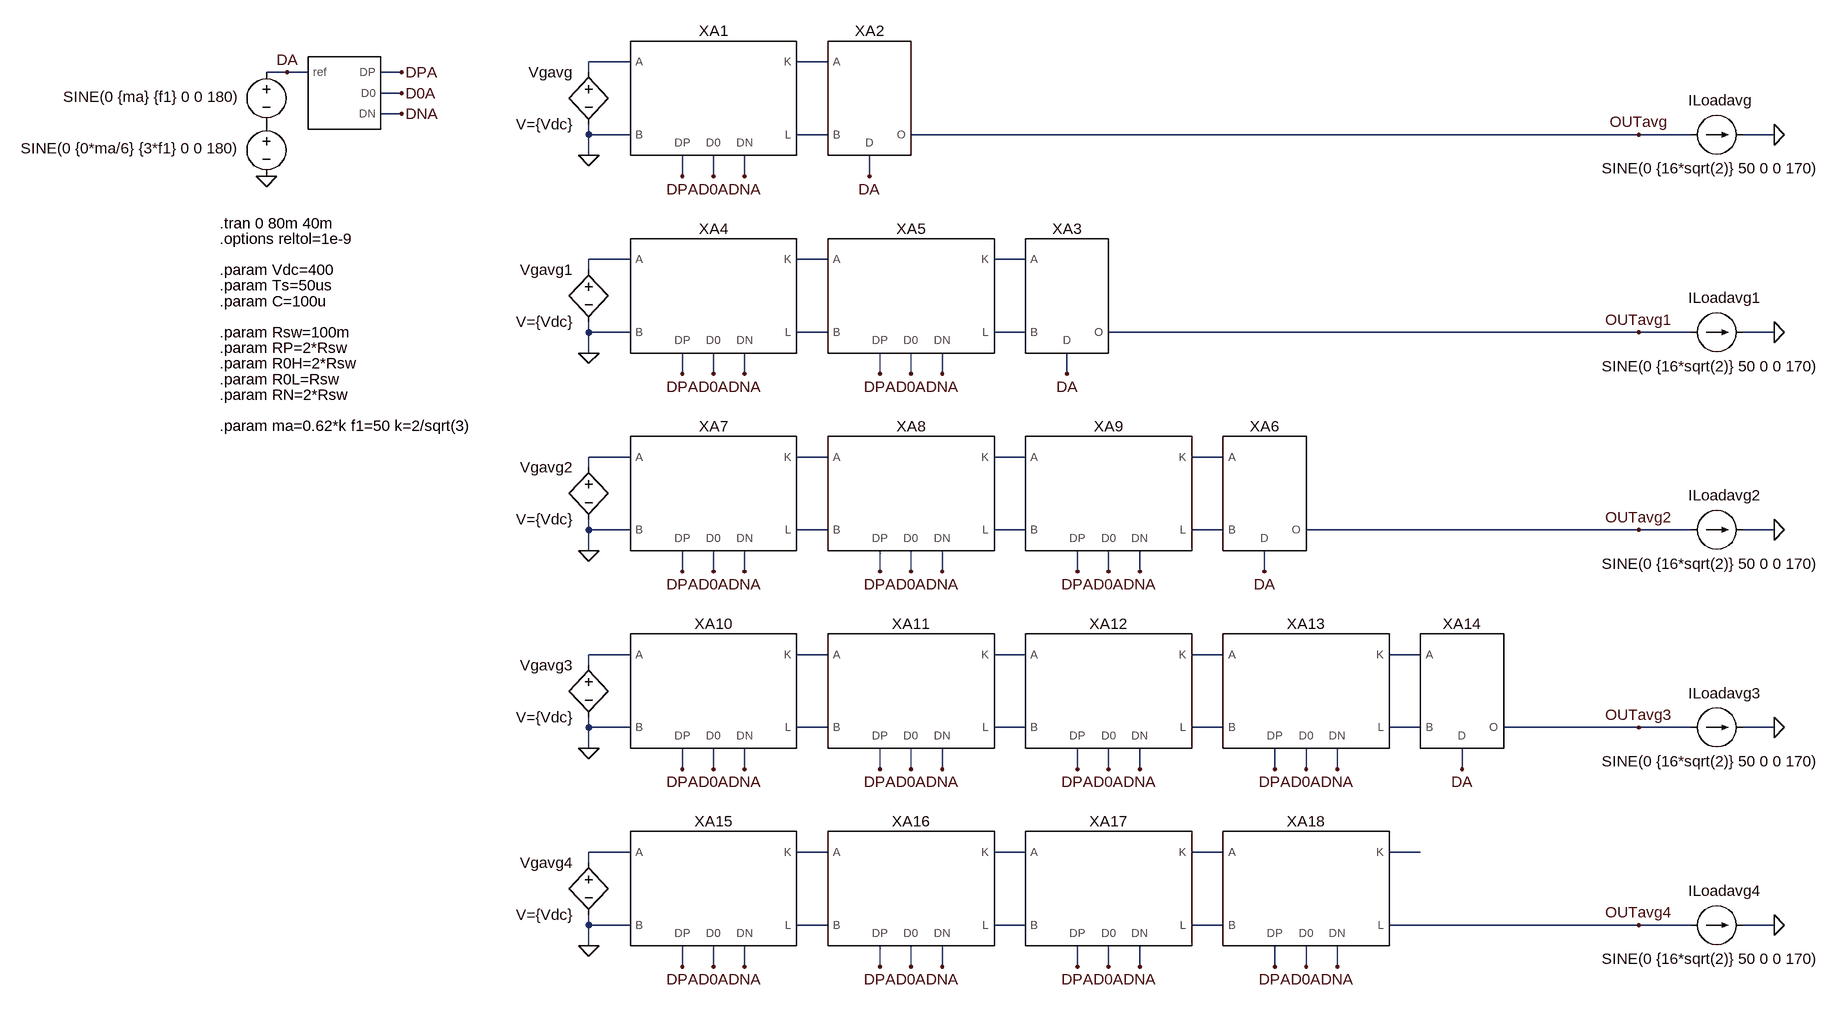
[diagram p0: schematic converter_scaling.asc]
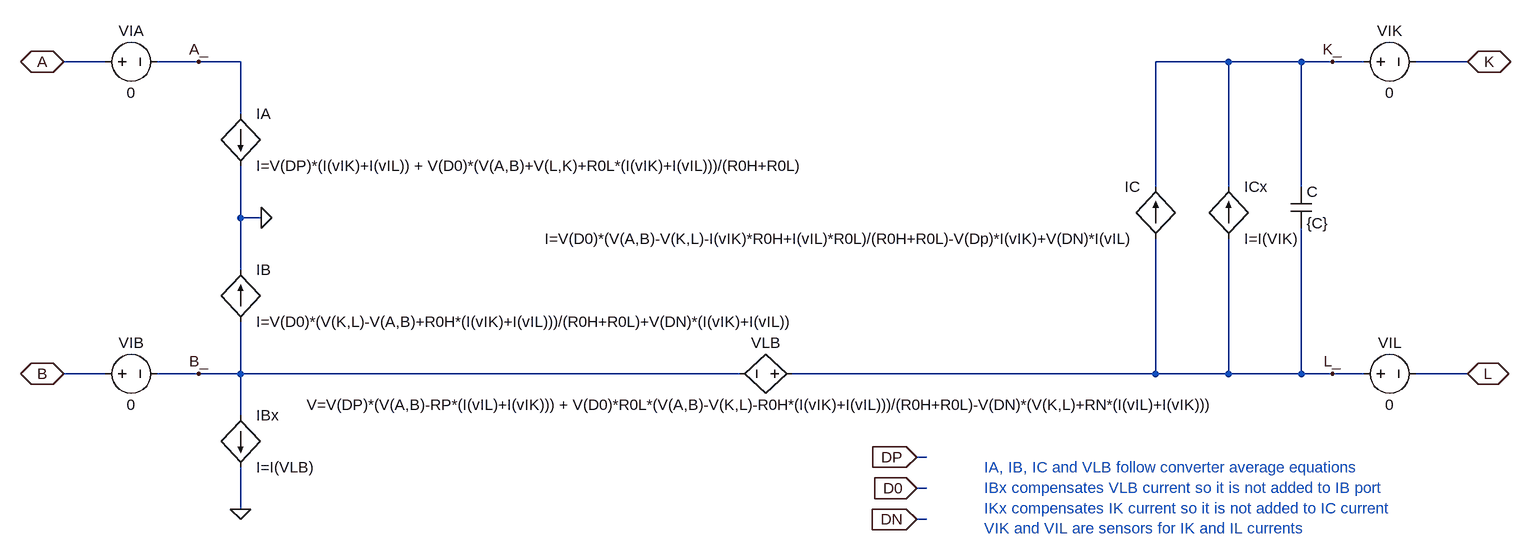
[diagram p1: sub-circuit pn_average_model.asc]
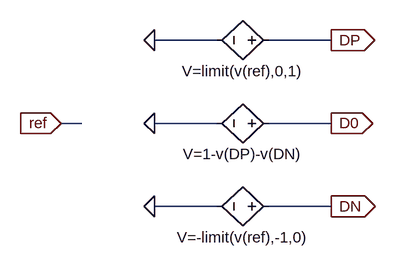
[diagram p2: sub-circuit pn_average_modulator.asc]
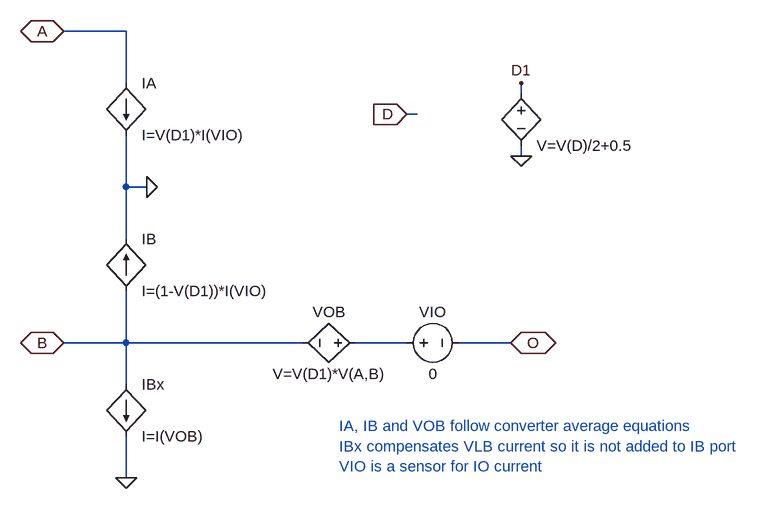
[diagram p3: sub-circuit 2l_average_model.asc]
converter_scaling.asc, the LTspice schematic file:
Version 4
SHEET 1 4616 1844
WIRE 2272 -1392 2208 -1392
WIRE 2576 -1392 2528 -1392
WIRE 1744 -1376 1712 -1376
WIRE 1776 -1376 1744 -1376
WIRE 1920 -1376 1888 -1376
WIRE 2208 -1376 2208 -1392
WIRE 1920 -1344 1888 -1344
WIRE 1920 -1312 1888 -1312
WIRE 2208 -1280 2208 -1296
WIRE 2272 -1280 2208 -1280
WIRE 2576 -1280 2528 -1280
WIRE 3824 -1280 2704 -1280
WIRE 3904 -1280 3824 -1280
WIRE 4032 -1280 3984 -1280
WIRE 2208 -1248 2208 -1280
WIRE 2352 -1216 2352 -1248
WIRE 2400 -1216 2400 -1248
WIRE 2448 -1216 2448 -1248
WIRE 2640 -1216 2640 -1248
WIRE 2272 -1088 2208 -1088
WIRE 2576 -1088 2528 -1088
WIRE 2880 -1088 2832 -1088
WIRE 2208 -1072 2208 -1088
WIRE 2208 -976 2208 -992
WIRE 2272 -976 2208 -976
WIRE 2576 -976 2528 -976
WIRE 2880 -976 2832 -976
WIRE 3824 -976 3008 -976
WIRE 3904 -976 3824 -976
WIRE 4032 -976 3984 -976
WIRE 2208 -944 2208 -976
WIRE 2352 -912 2352 -944
WIRE 2400 -912 2400 -944
WIRE 2448 -912 2448 -944
WIRE 2656 -912 2656 -944
WIRE 2704 -912 2704 -944
WIRE 2752 -912 2752 -944
WIRE 2944 -912 2944 -944
WIRE 2272 -784 2208 -784
WIRE 2576 -784 2528 -784
WIRE 2880 -784 2832 -784
WIRE 3184 -784 3136 -784
WIRE 2208 -768 2208 -784
WIRE 2208 -672 2208 -688
WIRE 2272 -672 2208 -672
WIRE 2576 -672 2528 -672
WIRE 2880 -672 2832 -672
WIRE 3184 -672 3136 -672
WIRE 3824 -672 3312 -672
WIRE 3904 -672 3824 -672
WIRE 4032 -672 3984 -672
WIRE 2208 -640 2208 -672
WIRE 2352 -608 2352 -640
WIRE 2400 -608 2400 -640
WIRE 2448 -608 2448 -640
WIRE 2656 -608 2656 -640
WIRE 2704 -608 2704 -640
WIRE 2752 -608 2752 -640
WIRE 2960 -608 2960 -640
WIRE 3008 -608 3008 -640
WIRE 3056 -608 3056 -640
WIRE 3248 -608 3248 -640
WIRE 2272 -480 2208 -480
WIRE 2576 -480 2528 -480
WIRE 2880 -480 2832 -480
WIRE 3184 -480 3136 -480
WIRE 3488 -480 3440 -480
WIRE 2208 -464 2208 -480
WIRE 2208 -368 2208 -384
WIRE 2272 -368 2208 -368
WIRE 2576 -368 2528 -368
WIRE 2880 -368 2832 -368
WIRE 3184 -368 3136 -368
WIRE 3488 -368 3440 -368
WIRE 3824 -368 3616 -368
WIRE 3904 -368 3824 -368
WIRE 4032 -368 3984 -368
WIRE 2208 -336 2208 -368
WIRE 2352 -304 2352 -336
WIRE 2400 -304 2400 -336
WIRE 2448 -304 2448 -336
WIRE 2656 -304 2656 -336
WIRE 2704 -304 2704 -336
WIRE 2752 -304 2752 -336
WIRE 2960 -304 2960 -336
WIRE 3008 -304 3008 -336
WIRE 3056 -304 3056 -336
WIRE 3264 -304 3264 -336
WIRE 3312 -304 3312 -336
WIRE 3360 -304 3360 -336
WIRE 3552 -304 3552 -336
WIRE 2272 -176 2208 -176
WIRE 2576 -176 2528 -176
WIRE 2880 -176 2832 -176
WIRE 3184 -176 3136 -176
WIRE 3488 -176 3440 -176
WIRE 2208 -160 2208 -176
WIRE 2208 -64 2208 -80
WIRE 2272 -64 2208 -64
WIRE 2576 -64 2528 -64
WIRE 2880 -64 2832 -64
WIRE 3184 -64 3136 -64
WIRE 3824 -64 3440 -64
WIRE 3904 -64 3824 -64
WIRE 4032 -64 3984 -64
WIRE 2208 -32 2208 -64
WIRE 2352 0 2352 -32
WIRE 2400 0 2400 -32
WIRE 2448 0 2448 -32
WIRE 2656 0 2656 -32
WIRE 2704 0 2704 -32
WIRE 2752 0 2752 -32
WIRE 2960 0 2960 -32
WIRE 3008 0 3008 -32
WIRE 3056 0 3056 -32
WIRE 3264 0 3264 -32
WIRE 3312 0 3312 -32
WIRE 3360 0 3360 -32
FLAG 2352 -1216 DPA
FLAG 2400 -1216 D0A
FLAG 2448 -1216 DNA
FLAG 2208 -1248 0
FLAG 1920 -1376 DPA
FLAG 1920 -1344 D0A
FLAG 1920 -1312 DNA
FLAG 1712 -1216 0
FLAG 1744 -1376 DA
FLAG 4032 -1280 0
FLAG 3824 -1280 OUTavg
FLAG 2352 -912 DPA
FLAG 2400 -912 D0A
FLAG 2448 -912 DNA
FLAG 2208 -944 0
FLAG 4032 -976 0
FLAG 3824 -976 OUTavg1
FLAG 2656 -912 DPA
FLAG 2704 -912 D0A
FLAG 2752 -912 DNA
FLAG 2352 -608 DPA
FLAG 2400 -608 D0A
FLAG 2448 -608 DNA
FLAG 2208 -640 0
FLAG 4032 -672 0
FLAG 3824 -672 OUTavg2
FLAG 2656 -608 DPA
FLAG 2704 -608 D0A
FLAG 2752 -608 DNA
FLAG 2960 -608 DPA
FLAG 3008 -608 D0A
FLAG 3056 -608 DNA
FLAG 2352 -304 DPA
FLAG 2400 -304 D0A
FLAG 2448 -304 DNA
FLAG 2208 -336 0
FLAG 4032 -368 0
FLAG 3824 -368 OUTavg3
FLAG 2656 -304 DPA
FLAG 2704 -304 D0A
FLAG 2752 -304 DNA
FLAG 2960 -304 DPA
FLAG 3008 -304 D0A
FLAG 3056 -304 DNA
FLAG 3264 -304 DPA
FLAG 3312 -304 D0A
FLAG 3360 -304 DNA
FLAG 2640 -1216 DA
FLAG 2944 -912 DA
FLAG 3248 -608 DA
FLAG 3552 -304 DA
FLAG 2352 0 DPA
FLAG 2400 0 D0A
FLAG 2448 0 DNA
FLAG 2208 -32 0
FLAG 4032 -64 0
FLAG 3824 -64 OUTavg4
FLAG 2656 0 DPA
FLAG 2704 0 D0A
FLAG 2752 0 DNA
FLAG 2960 0 DPA
FLAG 3008 0 D0A
FLAG 3056 0 DNA
FLAG 3264 0 DPA
FLAG 3312 0 D0A
FLAG 3360 0 DNA
SYMBOL bv 2208 -1392 M0
SYMATTR InstName Vgavg
SYMATTR Value V={Vdc}
SYMBOL PN_average_model 2400 -1344 R0
SYMATTR InstName XA1
SYMATTR SpiceLine C={C} RP={RP} R0H={R0H} R0L={R0L} RN={RN}
SYMBOL voltage 1712 -1392 M0
WINDOW 0 24 16 Invisible 2
WINDOW 3 39 54 Left 2
SYMATTR InstName V1
SYMATTR Value SINE(0 {ma} {f1} 0 0 180)
SYMBOL voltage 1712 -1312 M0
WINDOW 0 24 16 Invisible 2
WINDOW 3 39 53 Left 2
SYMATTR InstName V7
SYMATTR Value SINE(0 {0*ma/6} {3*f1} 0 0 180)
SYMBOL PN_average_modulator 1824 -1344 R0
WINDOW 0 8 -56 Invisible 2
SYMATTR InstName X2
SYMBOL current 3904 -1280 M90
WINDOW 123 0 0 Left 2
WINDOW 39 0 0 Left 2
WINDOW 3 52 -137 VRight 2
WINDOW 0 -53 -4 VRight 2
SYMATTR Value SINE(0 {16*sqrt(2)} 50 0 0 170)
SYMATTR InstName ILoadavg
SYMBOL bv 2208 -1088 M0
SYMATTR InstName Vgavg1
SYMATTR Value V={Vdc}
SYMBOL PN_average_model 2400 -1040 R0
SYMATTR InstName XA4
SYMATTR SpiceLine C={2*C} RP={RP/2} R0H={R0H/2} R0L={R0L/2} RN={RN/2}
SYMBOL current 3904 -976 M90
WINDOW 123 0 0 Left 2
WINDOW 39 0 0 Left 2
WINDOW 3 52 -137 VRight 2
WINDOW 0 -53 -4 VRight 2
SYMATTR Value SINE(0 {16*sqrt(2)} 50 0 0 170)
SYMATTR InstName ILoadavg1
SYMBOL PN_average_model 2704 -1040 R0
SYMATTR InstName XA5
SYMATTR SpiceLine C={C} RP={RP} R0H={R0H} R0L={R0L} RN={RN}
SYMBOL bv 2208 -784 M0
SYMATTR InstName Vgavg2
SYMATTR Value V={Vdc}
SYMBOL PN_average_model 2400 -736 R0
SYMATTR InstName XA7
SYMATTR SpiceLine C={C*3} RP={RP/3} R0H={R0H/3} R0L={R0L/3} RN={RN/3}
SYMBOL current 3904 -672 M90
WINDOW 123 0 0 Left 2
WINDOW 39 0 0 Left 2
WINDOW 3 52 -137 VRight 2
WINDOW 0 -53 -4 VRight 2
SYMATTR Value SINE(0 {16*sqrt(2)} 50 0 0 170)
SYMATTR InstName ILoadavg2
SYMBOL PN_average_model 2704 -736 R0
SYMATTR InstName XA8
SYMATTR SpiceLine C={C*2} RP={RP/2} R0H={R0H/2} R0L={R0L/2} RN={RN/2}
SYMBOL PN_average_model 3008 -736 R0
SYMATTR InstName XA9
SYMATTR SpiceLine C={C} RP={RP} R0H={R0H} R0L={R0L} RN={RN}
SYMBOL bv 2208 -480 M0
SYMATTR InstName Vgavg3
SYMATTR Value V={Vdc}
SYMBOL PN_average_model 2400 -432 R0
SYMATTR InstName XA10
SYMATTR SpiceLine C={C*4} RP={RP/4} R0H={R0H/4} R0L={R0L/4} RN={RN/4}
SYMBOL current 3904 -368 M90
WINDOW 123 0 0 Left 2
WINDOW 39 0 0 Left 2
WINDOW 3 52 -137 VRight 2
WINDOW 0 -53 -4 VRight 2
SYMATTR Value SINE(0 {16*sqrt(2)} 50 0 0 170)
SYMATTR InstName ILoadavg3
SYMBOL PN_average_model 2704 -432 R0
SYMATTR InstName XA11
SYMATTR SpiceLine C={C*3} RP={RP/3} R0H={R0H/3} R0L={R0L/3} RN={RN/3}
SYMBOL PN_average_model 3008 -432 R0
SYMATTR InstName XA12
SYMATTR SpiceLine C={C*2} RP={RP/2} R0H={R0H/2} R0L={R0L/2} RN={RN/2}
SYMBOL PN_average_model 3312 -432 R0
SYMATTR InstName XA13
SYMATTR SpiceLine C={C} RP={RP} R0H={R0H} R0L={R0L} RN={RN}
SYMBOL 2L_average_model 2640 -1360 R0
SYMATTR InstName XA2
SYMBOL 2L_average_model 2944 -1056 R0
SYMATTR InstName XA3
SYMBOL 2L_average_model 3248 -752 R0
SYMATTR InstName XA6
SYMBOL 2L_average_model 3552 -448 R0
SYMATTR InstName XA14
SYMBOL bv 2208 -176 M0
SYMATTR InstName Vgavg4
SYMATTR Value V={Vdc}
SYMBOL PN_average_model 2400 -128 R0
SYMATTR InstName XA15
SYMATTR SpiceLine C={C*4} RP={RP/4} R0H={R0H/4} R0L={R0L/4} RN={RN/4}
SYMBOL current 3904 -64 M90
WINDOW 123 0 0 Left 2
WINDOW 39 0 0 Left 2
WINDOW 3 52 -137 VRight 2
WINDOW 0 -53 -4 VRight 2
SYMATTR Value SINE(0 {16*sqrt(2)} 50 0 0 170)
SYMATTR InstName ILoadavg4
SYMBOL PN_average_model 2704 -128 R0
SYMATTR InstName XA16
SYMATTR SpiceLine C={C*3} RP={RP/3} R0H={R0H/3} R0L={R0L/3} RN={RN/3}
SYMBOL PN_average_model 3008 -128 R0
SYMATTR InstName XA17
SYMATTR SpiceLine C={C*2} RP={RP/2} R0H={R0H/2} R0L={R0L/2} RN={RN/2}
SYMBOL PN_average_model 3312 -128 R0
SYMATTR InstName XA18
SYMATTR SpiceLine C={C} RP={RP} R0H={R0H} R0L={R0L} RN={RN}
TEXT 1640 -1048 Left 2 !.param Ts=50us
TEXT 1640 -1144 Left 2 !.tran 0 80m 40m
TEXT 1640 -1072 Left 2 !.param Vdc=400
TEXT 1640 -832 Left 2 !.param ma=0.62*k f1=50 k=2/sqrt(3)
TEXT 1640 -976 Left 2 !.param Rsw=100m
TEXT 1640 -952 Left 2 !.param RP=2*Rsw
TEXT 1640 -880 Left 2 !.param RN=2*Rsw
TEXT 1640 -928 Left 2 !.param R0H=2*Rsw
TEXT 1640 -904 Left 2 !.param R0L=Rsw
TEXT 1640 -1024 Left 2 !.param C=100u
TEXT 1640 -1120 Left 2 !.options reltol=1e-9

pn_average_model.asc, the sub-circuit schematic file:
Version 4
SHEET 1 2060 780
WIRE -720 16 -784 16
WIRE -576 16 -640 16
WIRE -512 16 -576 16
WIRE 1008 16 896 16
WIRE 1120 16 1008 16
WIRE 1168 16 1120 16
WIRE 1216 16 1168 16
WIRE 1376 16 1296 16
WIRE -512 96 -512 16
WIRE 896 208 896 16
WIRE 1008 208 1008 16
WIRE 1120 208 1120 16
WIRE -512 256 -512 176
WIRE -480 256 -512 256
WIRE -512 336 -512 256
WIRE -720 496 -784 496
WIRE -576 496 -640 496
WIRE -512 496 -512 416
WIRE -512 496 -576 496
WIRE 256 496 -512 496
WIRE 896 496 896 288
WIRE 896 496 336 496
WIRE 1008 496 1008 288
WIRE 1008 496 896 496
WIRE 1120 496 1120 272
WIRE 1120 496 1008 496
WIRE 1168 496 1120 496
WIRE 1216 496 1168 496
WIRE 1376 496 1296 496
WIRE -512 560 -512 496
WIRE 544 624 528 624
WIRE 544 672 528 672
WIRE -512 704 -512 640
WIRE 544 720 528 720
FLAG 1376 16 K
IOPIN 1376 16 BiDir
FLAG 1376 496 L
IOPIN 1376 496 BiDir
FLAG -784 16 A
IOPIN -784 16 BiDir
FLAG -784 496 B
IOPIN -784 496 BiDir
FLAG 528 624 DP
IOPIN 528 624 In
FLAG 528 672 D0
IOPIN 528 672 In
FLAG 528 720 DN
IOPIN 528 720 In
FLAG -480 256 0
FLAG -512 704 0
FLAG -576 16 A_
FLAG -576 496 B_
FLAG 1168 16 K_
FLAG 1168 496 L_
SYMBOL bv 352 496 R90
WINDOW 0 -32 56 VBottom 2
WINDOW 3 32 56 VTop 2
SYMATTR InstName VLB
SYMATTR Value V=V(DP)*(V(A,B)-RP*(I(vIL)+I(vIK))) + V(D0)*R0L*(V(A,B)-V(K,L)-R0H*(I(vIK)+I(vIL)))/(R0H+R0L)-V(DN)*(V(K,L)+RN*(I(vIL)+I(vIK)))
SYMBOL bi -512 96 R0
SYMATTR InstName IA
SYMATTR Value I=V(DP)*(I(vIK)+I(vIL)) + V(D0)*(V(A,B)+V(L,K)+R0L*(I(vIK)+I(vIL)))/(R0H+R0L)
SYMBOL cap 1104 208 R0
SYMATTR InstName C
SYMATTR Value {C}
SYMBOL bi 896 288 R180
WINDOW 0 24 80 Left 2
WINDOW 3 24 0 Left 2
SYMATTR InstName IC
SYMATTR Value I=V(D0)*(V(A,B)-V(K,L)-I(vIK)*R0H+I(vIL)*R0L)/(R0H+R0L)-V(Dp)*I(vIK)+V(DN)*I(vIL)
SYMBOL bi -512 416 M180
WINDOW 0 24 80 Left 2
WINDOW 3 24 0 Left 2
SYMATTR InstName IB
SYMATTR Value I=V(D0)*(V(K,L)-V(A,B)+R0H*(I(vIK)+I(vIL)))/(R0H+R0L)+V(DN)*(I(vIK)+I(vIL))
SYMBOL voltage 1200 496 R270
WINDOW 0 32 56 VTop 2
WINDOW 3 -32 56 VBottom 2
SYMATTR InstName VIL
SYMATTR Value 0
SYMBOL voltage 1200 16 R270
WINDOW 0 32 56 VTop 2
WINDOW 3 -32 56 VBottom 2
SYMATTR InstName VIK
SYMATTR Value 0
SYMBOL bi -512 560 R0
SYMATTR InstName IBx
SYMATTR Value I=I(VLB)
SYMBOL bi 1008 288 M180
WINDOW 0 24 80 Left 2
WINDOW 3 24 0 Left 2
SYMATTR InstName ICx
SYMATTR Value I=I(VIK)
SYMBOL voltage -736 496 R270
WINDOW 0 32 56 VTop 2
WINDOW 3 -32 56 VBottom 2
SYMATTR InstName VIB
SYMATTR Value 0
SYMBOL voltage -736 16 R270
WINDOW 0 32 56 VTop 2
WINDOW 3 -32 56 VBottom 2
SYMATTR InstName VIA
SYMATTR Value 0
TEXT 632 640 Left 2 ;IA, IB, IC and VLB follow converter average equations\nIBx compensates VLB current so it is not added to IB port\nIKx compensates IK current so it is not added to IC current\nVIK and VIL are sensors for IK and IL currents

pn_average_modulator.asc, the sub-circuit schematic file:
Version 4
SHEET 1 880 680
WIRE 304 160 208 160
WIRE 480 160 384 160
WIRE 96 288 64 288
WIRE 304 288 208 288
WIRE 480 288 384 288
WIRE 304 416 208 416
WIRE 480 416 384 416
FLAG 208 160 0
FLAG 208 288 0
FLAG 208 416 0
FLAG 480 160 DP
IOPIN 480 160 Out
FLAG 480 288 D0
IOPIN 480 288 Out
FLAG 480 416 DN
IOPIN 480 416 Out
FLAG 64 288 ref
IOPIN 64 288 In
SYMBOL bv 400 160 R90
WINDOW 0 -32 56 Invisible 2
WINDOW 3 32 56 VTop 2
SYMATTR InstName Bpos1
SYMATTR Value V=limit(v(ref),0,1)
SYMBOL bv 400 288 R90
WINDOW 0 -32 56 Invisible 2
WINDOW 3 32 56 VTop 2
SYMATTR InstName Bzero1
SYMATTR Value V=1-v(DP)-v(DN)
SYMBOL bv 400 416 R90
WINDOW 0 -32 56 Invisible 2
WINDOW 3 32 56 VTop 2
SYMATTR InstName Bneg1
SYMATTR Value V=-limit(v(ref),-1,0)

2l_average_model.asc, the sub-circuit schematic file:
Version 4
SHEET 1 2060 780
WIRE -512 16 -608 16
WIRE -512 96 -512 16
WIRE 96 112 96 96
WIRE -64 144 -80 144
WIRE 96 208 96 192
WIRE -512 256 -512 176
WIRE -480 256 -512 256
WIRE -512 336 -512 256
WIRE -512 496 -512 416
WIRE -512 496 -608 496
WIRE -240 496 -512 496
WIRE -80 496 -160 496
WIRE 80 496 0 496
WIRE -512 560 -512 496
WIRE -512 704 -512 640
FLAG 80 496 O
IOPIN 80 496 BiDir
FLAG -608 16 A
IOPIN -608 16 BiDir
FLAG -608 496 B
IOPIN -608 496 BiDir
FLAG -80 144 D
IOPIN -80 144 In
FLAG -480 256 0
FLAG -512 704 0
FLAG 96 208 0
FLAG 96 96 D1
SYMBOL bv -144 496 R90
WINDOW 0 -32 56 VBottom 2
WINDOW 3 32 56 VTop 2
SYMATTR InstName VOB
SYMATTR Value V=V(D1)*V(A,B)
SYMBOL bi -512 96 R0
SYMATTR InstName IA
SYMATTR Value I=V(D1)*I(VIO)
SYMBOL bi -512 416 M180
WINDOW 0 24 80 Left 2
WINDOW 3 24 0 Left 2
SYMATTR InstName IB
SYMATTR Value I=(1-V(D1))*I(VIO)
SYMBOL voltage -96 496 R270
WINDOW 0 32 56 VTop 2
WINDOW 3 -32 56 VBottom 2
SYMATTR InstName VIO
SYMATTR Value 0
SYMBOL bi -512 560 R0
SYMATTR InstName IBx
SYMATTR Value I=I(VOB)
SYMBOL bv 96 96 R0
WINDOW 0 24 16 Invisible 2
SYMATTR InstName VD
SYMATTR Value V=V(D)/2+0.5
TEXT -184 624 Left 2 ;IA, IB and VOB follow converter average equations\nIBx compensates VLB current so it is not added to IB port\nVIO is a sensor for IO current

The netlist it stands for:
* converter_scaling.asc
B§Vgavg N001 0 V={Vdc}
XXA1 D0A DNA DPA N001 0 N002 N003 pn_average_model params: C={C} RP={RP} R0H={R0H} R0L={R0L} RN={RN}
V1 DA P001 SINE(0 {ma} {f1} 0 0 180)
V7 P001 0 SINE(0 {0*ma/6} {3*f1} 0 0 180)
XX2 DA D0A DNA DPA pn_average_modulator
ILoadavg OUTavg 0 SINE(0 {16*sqrt(2)} 50 0 0 170)
B§Vgavg1 N004 0 V={Vdc}
XXA4 D0A DNA DPA N004 0 N005 N007 pn_average_model params: C={2*C} RP={RP/2} R0H={R0H/2} R0L={R0L/2} RN={RN/2}
ILoadavg1 OUTavg1 0 SINE(0 {16*sqrt(2)} 50 0 0 170)
XXA5 D0A DNA DPA N005 N007 N006 N008 pn_average_model params: C={C} RP={RP} R0H={R0H} R0L={R0L} RN={RN}
B§Vgavg2 N009 0 V={Vdc}
XXA7 D0A DNA DPA N009 0 N010 N013 pn_average_model params: C={C*3} RP={RP/3} R0H={R0H/3} R0L={R0L/3} RN={RN/3}
ILoadavg2 OUTavg2 0 SINE(0 {16*sqrt(2)} 50 0 0 170)
XXA8 D0A DNA DPA N010 N013 N011 N014 pn_average_model params: C={C*2} RP={RP/2} R0H={R0H/2} R0L={R0L/2} RN={RN/2}
XXA9 D0A DNA DPA N011 N014 N012 N015 pn_average_model params: C={C} RP={RP} R0H={R0H} R0L={R0L} RN={RN}
B§Vgavg3 N016 0 V={Vdc}
XXA10 D0A DNA DPA N016 0 N017 N021 pn_average_model params: C={C*4} RP={RP/4} R0H={R0H/4} R0L={R0L/4} RN={RN/4}
ILoadavg3 OUTavg3 0 SINE(0 {16*sqrt(2)} 50 0 0 170)
XXA11 D0A DNA DPA N017 N021 N018 N022 pn_average_model params: C={C*3} RP={RP/3} R0H={R0H/3} R0L={R0L/3} RN={RN/3}
XXA12 D0A DNA DPA N018 N022 N019 N023 pn_average_model params: C={C*2} RP={RP/2} R0H={R0H/2} R0L={R0L/2} RN={RN/2}
XXA13 D0A DNA DPA N019 N023 N020 N024 pn_average_model params: C={C} RP={RP} R0H={R0H} R0L={R0L} RN={RN}
XXA2 DA N002 N003 OUTavg 2l_average_model
XXA3 DA N006 N008 OUTavg1 2l_average_model
XXA6 DA N012 N015 OUTavg2 2l_average_model
XXA14 DA N020 N024 OUTavg3 2l_average_model
B§Vgavg4 N025 0 V={Vdc}
XXA15 D0A DNA DPA N025 0 N026 N030 pn_average_model params: C={C*4} RP={RP/4} R0H={R0H/4} R0L={R0L/4} RN={RN/4}
ILoadavg4 OUTavg4 0 SINE(0 {16*sqrt(2)} 50 0 0 170)
XXA16 D0A DNA DPA N026 N030 N027 N031 pn_average_model params: C={C*3} RP={RP/3} R0H={R0H/3} R0L={R0L/3} RN={RN/3}
XXA17 D0A DNA DPA N027 N031 N028 N032 pn_average_model params: C={C*2} RP={RP/2} R0H={R0H/2} R0L={R0L/2} RN={RN/2}
XXA18 D0A DNA DPA N028 N032 N029 OUTavg4 pn_average_model params: C={C} RP={RP} R0H={R0H} R0L={R0L} RN={RN}

* block symbol definitions
.subckt pn_average_model D0 DN DP A B K L
B§VLB L_ B_ V=V(DP)*(V(A,B)-RP*(I(vIL)+I(vIK))) + V(D0)*R0L*(V(A,B)-V(K,L)-R0H*(I(vIK)+I(vIL)))/(R0H+R0L)-V(DN)*(V(K,L)+RN*(I(vIL)+I(vIK)))
B§IA A_ 0 I=V(DP)*(I(vIK)+I(vIL)) + V(D0)*(V(A,B)+V(L,K)+R0L*(I(vIK)+I(vIL)))/(R0H+R0L)
C K_ L_ {C}
B§IC L_ K_ I=V(D0)*(V(A,B)-V(K,L)-I(vIK)*R0H+I(vIL)*R0L)/(R0H+R0L)-V(Dp)*I(vIK)+V(DN)*I(vIL)
B§IB B_ 0 I=V(D0)*(V(K,L)-V(A,B)+R0H*(I(vIK)+I(vIL)))/(R0H+R0L)+V(DN)*(I(vIK)+I(vIL))
VIL L_ L 0
VIK K_ K 0
B§IBx B_ 0 I=I(VLB)
B§ICx L_ K_ I=I(VIK)
VIB B B_ 0
VIA A A_ 0
* IA, IB, IC and VLB follow converter average equations
* IBx compensates VLB current so it is not added to IB port
* IKx compensates IK current so it is not added to IC current
* VIK and VIL are sensors for IK and IL currents
.ends pn_average_model

.subckt pn_average_modulator ref D0 DN DP
Bpos1 DP 0 V=limit(v(ref),0,1)
Bzero1 D0 0 V=1-v(DP)-v(DN)
Bneg1 DN 0 V=-limit(v(ref),-1,0)
.ends pn_average_modulator

.subckt 2l_average_model D A B O
B§VOB N001 B V=V(D1)*V(A,B)
B§IA A 0 I=V(D1)*I(VIO)
B§IB B 0 I=(1-V(D1))*I(VIO)
VIO N001 O 0
B§IBx B 0 I=I(VOB)
B§VD D1 0 V=V(D)/2+0.5
* IA, IB and VOB follow converter average equations
* IBx compensates VLB current so it is not added to IB port
* VIO is a sensor for IO current
.ends 2l_average_model

.param Ts=50us
.tran 0 80m 40m
.param Vdc=400
.param ma=0.62*k f1=50 k=2/sqrt(3)
.param Rsw=100m
.param RP=2*Rsw
.param RN=2*Rsw
.param R0H=2*Rsw
.param R0L=Rsw
.param C=100u
.options reltol=1e-9
.backanno
.end